# Altium project SA_ULWUR.PrjPcb
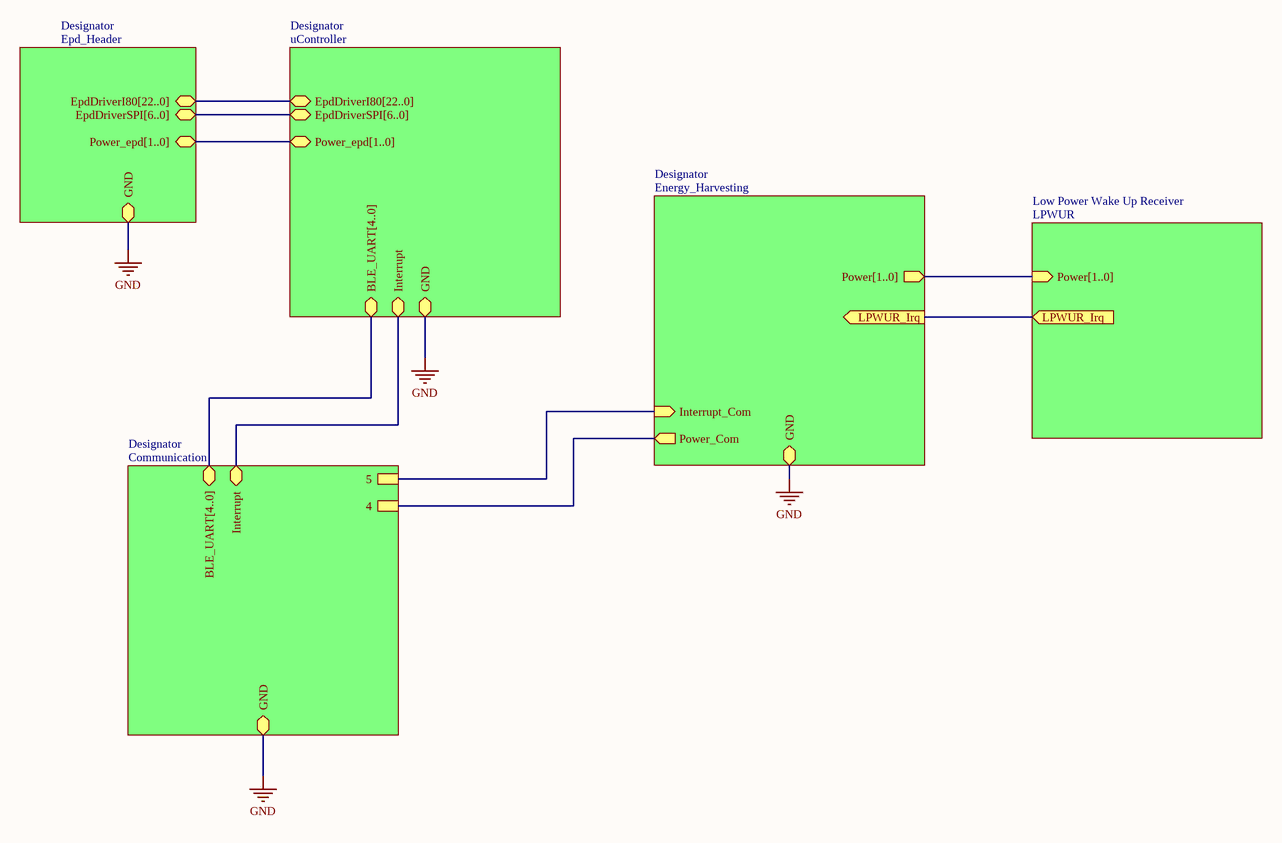
[diagram p0: Blockschaltbild.SchDoc]
7 sheets, 16 parts. Net scope: hierarchical (ports join the sheet entries above them; power ports are global).
Sheets:
  Blockschaltbild.SchDoc
    Designator = Epd_Header.SchDoc
    Designator = uController.SchDoc
    Designator = Communication.SchDoc
    Designator = Energy_Harvesting.SchDoc
  Epd.SchDoc
  Latch power supply.SchDoc

## Sheet Blockschaltbild.SchDoc: ULPWUR
size A3; Date: 11.11.2019; Author: Cédric Renda; CompanyName: HSR; DrawnBy: Cédric Renda; Organization: HSR

### Sub-sheets
Designator = Epd_Header: GND (bidir), Power_epd[1..0] (bidir), EpdDriverI80[22..0] (bidir), EpdDriverSPI[6..0] (bidir)
Designator = uController: Interrupt (bidir), Power_epd[1..0] (bidir), GND (bidir), EpdDriverI80[22..0] (bidir), BLE_UART[4..0] (bidir), EpdDriverSPI[6..0] (bidir)
Designator = Communication: 4, 5, Interrupt (bidir), GND (bidir), BLE_UART[4..0] (bidir)
Designator = Energy_Harvesting: Power_Com (out), Interrupt_Com (in), GND (bidir), Power[1..0] (out)
Low Power Wake Up Receiver = LPWUR (file not in this document): Power[1..0] (in)

### Ports
LPWUR_Irq (in), LPWUR_Irq (out)

### Nets
GND: sheet Designator/GND, sheet Designator/GND, sheet Designator/GND, sheet Designator/GND
(unnamed): sheet Designator/Interrupt, sheet Designator/Interrupt
(unnamed): sheet Designator/4, sheet Designator/Power_Com
(unnamed): sheet Designator/5, sheet Designator/Interrupt_Com

### Buses and harness runs
bus sheet Designator/Power[1..0] = sheet Low Power Wake Up Receiver/Power[1..0]

## Sheet Epd_Header.SchDoc
size A3
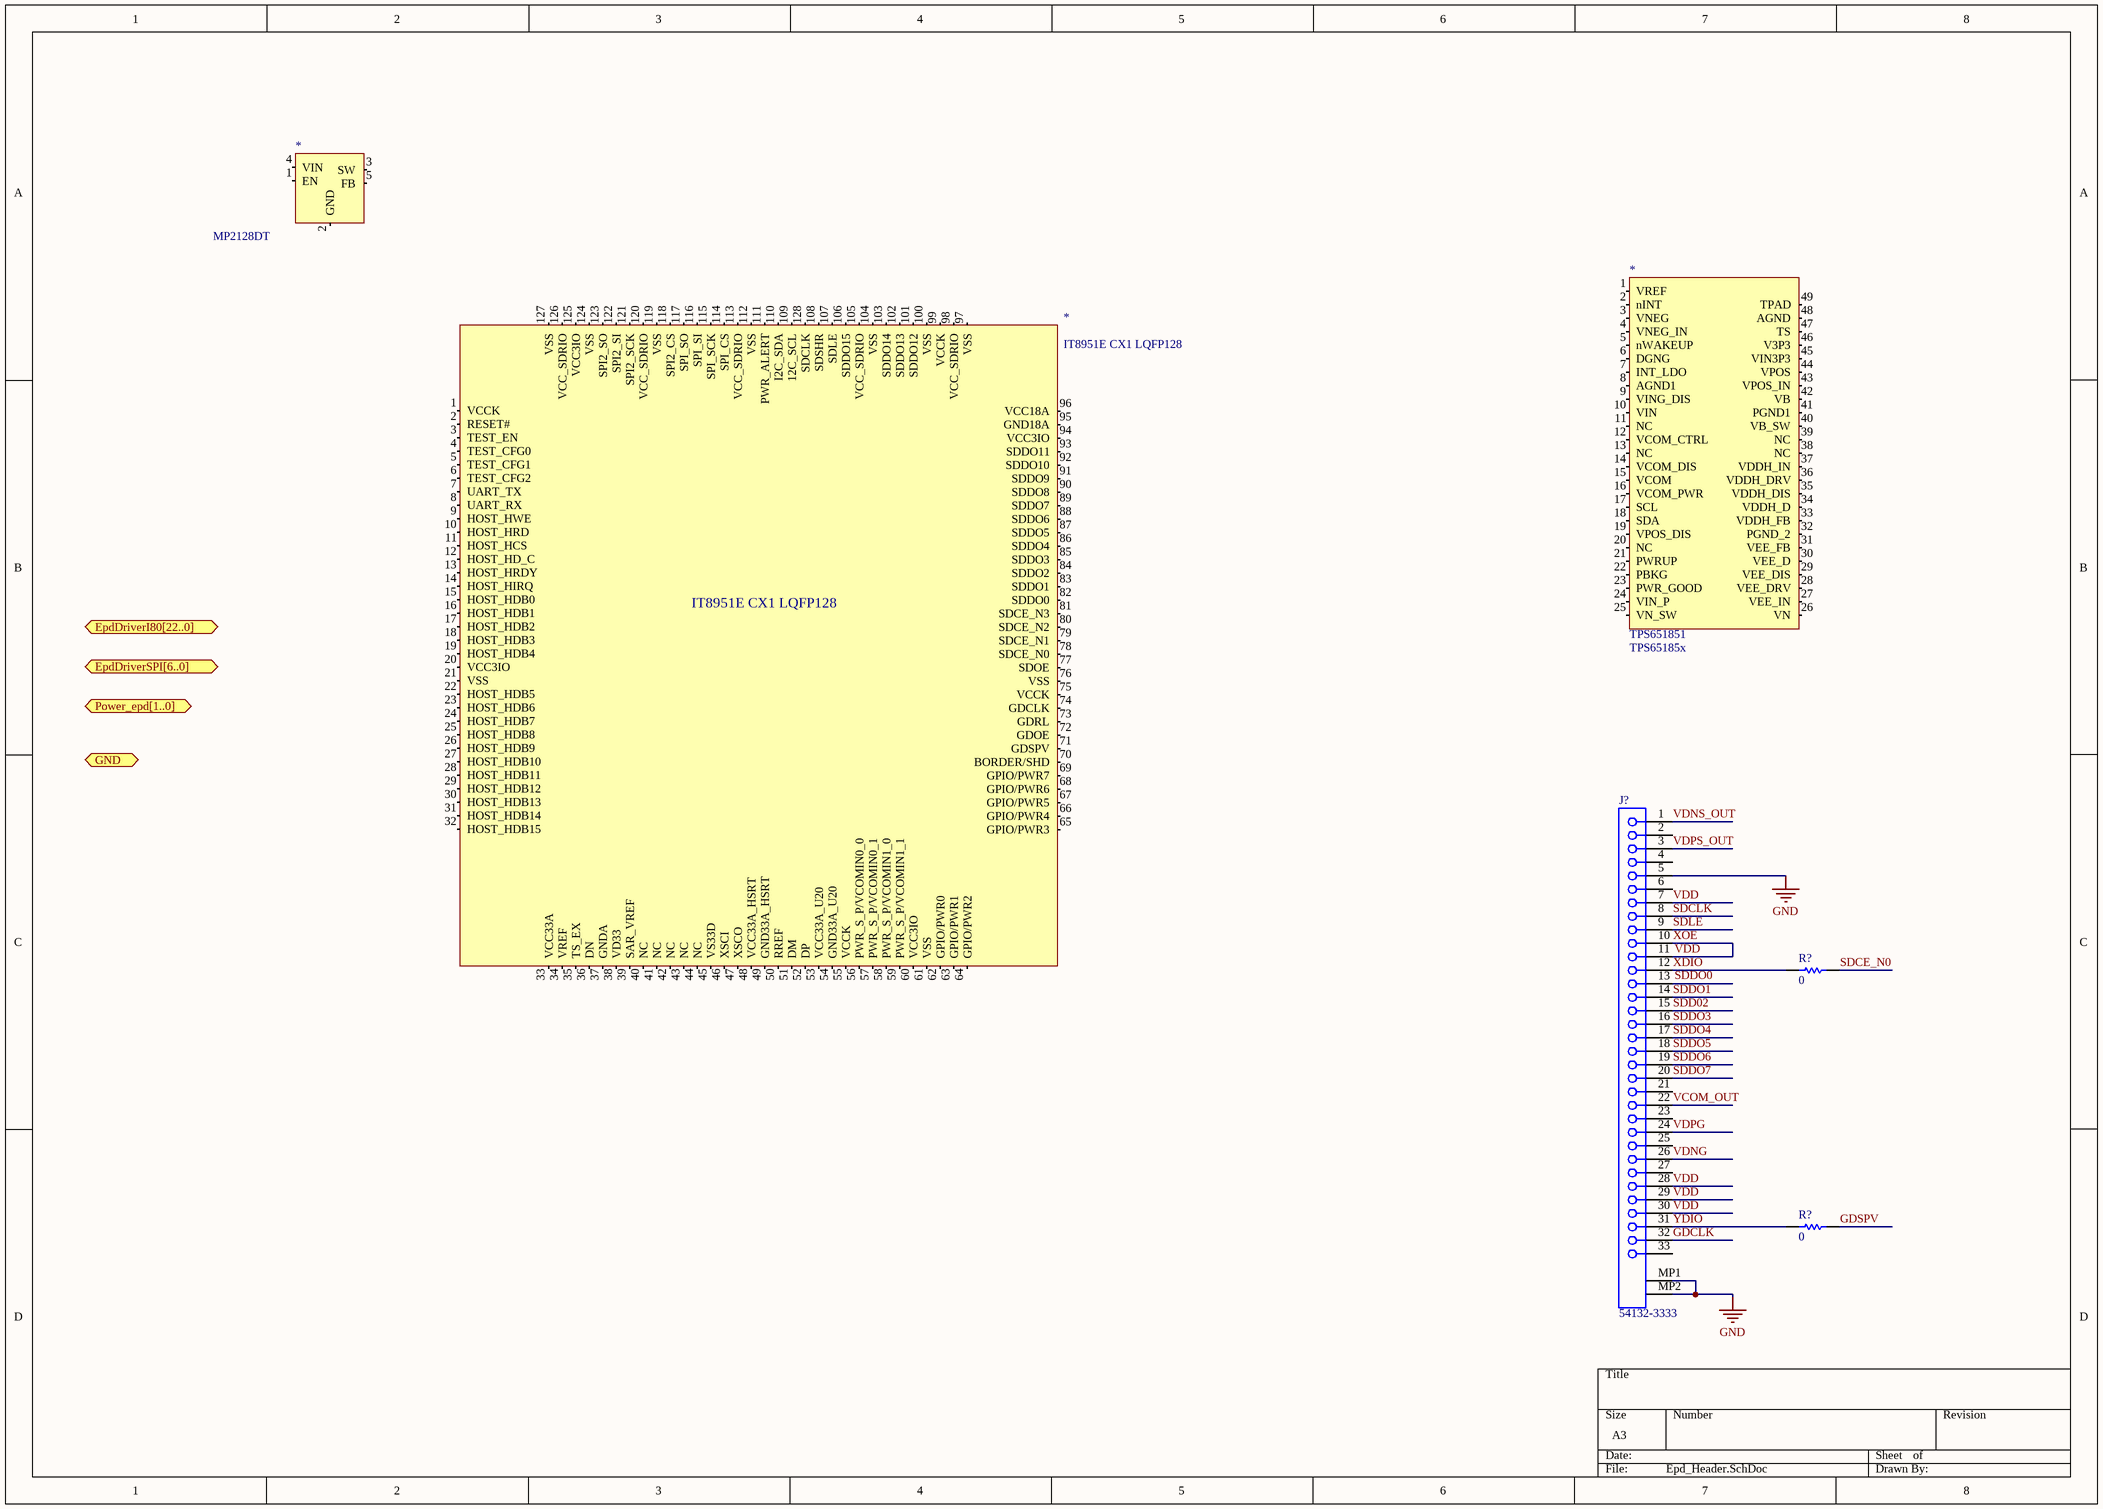
[diagram p1: Epd_Header.SchDoc]

### Parts
(Parts that share a designator on the sheet are numbered #1, #2 ... from top to bottom, then left to right.)
*#1  MP2128DT
*#2  TPS651851  Parameter 1: TPS65185x
*#3  ITEM: IT8951E CX1 LQFP128  (hidden comment: IT8951E DX LQFP128)
J?  54132-3333  [MOLX-54132-3333]
R?#1  0  [0603R]
R?#2  0  [0603R]

### Ports
EpdDriverI80[22..0] (bidir), EpdDriverSPI[6..0] (bidir), GND (bidir), Power_epd[1..0] (bidir)

### Nets
GND: J?.5 J?.MP1 J?.MP2 ; port GND
GDCLK: J?.32
GDSPV: R?#2.2
SDCE_N0: R?#1.2
SDCLK: J?.8
SDD02: J?.15
SDDO1: J?.14
SDDO3: J?.16
SDDO4: J?.17
SDDO5: J?.18
SDDO6: J?.19
SDDO7: J?.20
SDLE: J?.9
VCOM_OUT: J?.22
VDD: J?.7 J?.10 J?.11 J?.28 J?.29 J?.30  [also labelled XOE]
VDNG: J?.26
VDNS_OUT: J?.1
VDPG: J?.24
VDPS_OUT: J?.3
XDIO: J?.12 R?#1.1
YDIO: J?.31 R?#2.1

Not connected (* = marked no-connect by the designer): *#1 1(EN) 2(GND) 3(SW) 4(VIN) 5(FB); *#2 1(VREF) 2(nINT) 3(VNEG) 4(VNEG_IN) 5(nWAKEUP) 6(DGNG) 7(INT_LDO) 8(AGND1) 9(VING_DIS) 10(VIN) 11(NC) 12(VCOM_CTRL) 13(NC) 14(VCOM_DIS) 15(VCOM) 16(VCOM_PWR) 17(SCL) 18(SDA) 19(VPOS_DIS) 20(NC) 21(PWRUP) 22(PBKG) 23(PWR_GOOD) 24(VIN_P) 25(VN_SW) 26(VN) 27(VEE_IN) 28(VEE_DRV) 29(VEE_DIS) 30(VEE_D) 31(VEE_FB) 32(PGND_2) 33(VDDH_FB) 34(VDDH_D) 35(VDDH_DIS) 36(VDDH_DRV) 37(VDDH_IN) 38(NC) 39(NC) 40(VB_SW) 41(PGND1) 42(VB) 43(VPOS_IN) 44(VPOS) 45(VIN3P3) 46(V3P3) 47(TS) 48(AGND) 49(TPAD); *#3 1(VCCK) 2(RESET#) 3(TEST_EN) 4(TEST_CFG0) 5(TEST_CFG1) 6(TEST_CFG2) 7(UART_TX) 8(UART_RX) 9(HOST_HWE) 10(HOST_HRD) 11(HOST_HCS) 12(HOST_HD_C) 13(HOST_HRDY) 14(HOST_HIRQ) 15(HOST_HDB0) 16(HOST_HDB1) 17(HOST_HDB2) 18(HOST_HDB3) 19(HOST_HDB4) 20(VCC3IO) 21(VSS) 22(HOST_HDB5) 23(HOST_HDB6) 24(HOST_HDB7) 25(HOST_HDB8) 26(HOST_HDB9) 27(HOST_HDB10) 28(HOST_HDB11) 29(HOST_HDB12) 30(HOST_HDB13) 31(HOST_HDB14) 32(HOST_HDB15) 33(VCC33A) 34(VREF) 35(TS_EX) 36(DN) 37(GNDA) 38(VD33) 39(SAR_VREF) 40(NC) 41(NC) 42(NC) 43(NC) 44(NC) 45(VS33D) 46(XSCI) 47(XSCO) 48(VCC33A_HSRT) 49(GND33A_HSRT) 50(RREF) 51(DM) 52(DP) 53(VCC33A_U20) 54(GND33A_U20) 55(VCCK) 56(PWR_S_P/VCOMIN0_0) 57(PWR_S_P/VCOMIN0_1) 58(PWR_S_P/VCOMIN1_0) 59(PWR_S_P/VCOMIN1_1) 60(VCC3IO) 61(VSS) 62(GPIO/PWR0) 63(GPIO/PWR1) 64(GPIO/PWR2) 65(GPIO/PWR3) 66(GPIO/PWR4) 67(GPIO/PWR5) 68(GPIO/PWR6) 69(GPIO/PWR7) 70(BORDER/SHD) 71(GDSPV) 72(GDOE) 73(GDRL) 74(GDCLK) 75(VCCK) 76(VSS) 77(SDOE) 78(SDCE_N0) 79(SDCE_N1) 80(SDCE_N2) 81(SDCE_N3) 82(SDDO0) 83(SDDO1) 84(SDDO2) 85(SDDO3) 86(SDDO4) 87(SDDO5) 88(SDDO6) 89(SDDO7) 90(SDDO8) 91(SDDO9) 92(SDDO10) 93(SDDO11) 94(VCC3IO) 95(GND18A) 96(VCC18A) 97(VSS) 98(VCC_SDRIO) 99(VCCK) 100(VSS) 101(SDDO12) 102(SDDO13) 103(SDDO14) 104(VSS) 105(VCC_SDRIO) 106(SDDO15) 107(SDLE) 108(SDSHR) 109(12C_SCL) 110(I2C_SDA) 111(PWR_ALERT) 112(VSS) 113(VCC_SDRIO) 114(SPI_CS) 115(SPI_SCK) 116(SPI_SI) 117(SPI_SO) 118(SPI2_CS) 119(VSS) 120(VCC_SDRIO) 121(SPI2_SCK) 122(SPI2_SI) 123(SPI2_SO) 124(VSS) 125(VCC3IO) 126(VCC_SDRIO) 127(VSS) 128(SDCLK); J? 2 4 6 13 21 23 25 27 33

### Notes on the sheet
- Labels drawn without touching a wire or pin: SDDO0

### Library data of the parts
*#1 = MP2128DT: MP2128DT Step down 2.5-6V to 1.8V 1A
*#2 = TPS651851: TPS651851 TPS65185x PMIC for E Ink® Vizplex™ Enabled Electronic Paper Display /
J? = CMP-1241-00520-1: 0.5 mm Pitch Easy-On(TM) Type FPC Connector, 2.0 mm Mated Height, Right Angle, ZIF, SMT, Bottom Contact, 33 Circuits, -40 to 85 degC, ELV and RoHS Compliant, Tape and Reel; Manufacturer: Molex; PCB Retention: None; Voltage (Max): 50V; Durability (mating cycles max): 20; Material - Metal: Phosphor Bronze; Entry Angle: 90degrees Angle; Pitch - Mating Interface: 0.50mm; Mated Height: 2.00mm; Material - Plating Mating: Silver, Tin-Bismuth; Circuits (Loaded): 33; Polarized to PCB: Yes; Current (Max per Contact): 0.5A; Stackable: No; ComponentLink1URL: http://www.molex.com/molex/index.jsp; Number of Rows: 1; PackageVersion: Rev. A, 08/2013; ComponentLink2Description: Datasheet; PackageReference: 54132-3333; ComponentLink3URL: http://www.molex.com/pdm_docs/sd/541323333_sd.pdf; ComponentLink2URL: http://www.molex.com/webdocs/datasheets/pdf/en-us/0541323333_FFC_FPC_CONNECTORS.pdf; Mounting Technology: Surface Mount; Contact Position: Bottom; PackageDescription: 33-Lead FPC Connector, Pitch 0.5 mm; Pitch - Termination Interface: 0.50mm; ComponentLink1Description: Manufacturer URL; PartNumber: 54132-3333; RoHS: TRUE; Material - Plating Termination: Silver, Tin-Bismuth; Packing: Tape and Reel; PCB Locator: No; ComponentLink3Description: Package Specification; Orientation: Right Angle
R?#1 R?#2 = Res1_1: Resistor; Value: 1K; Published: 8-Jun-2000; Revision: July-2002: Re-released for DXP Platform.; Publisher: Altium Limited

## Sheet uController.SchDoc
size A4
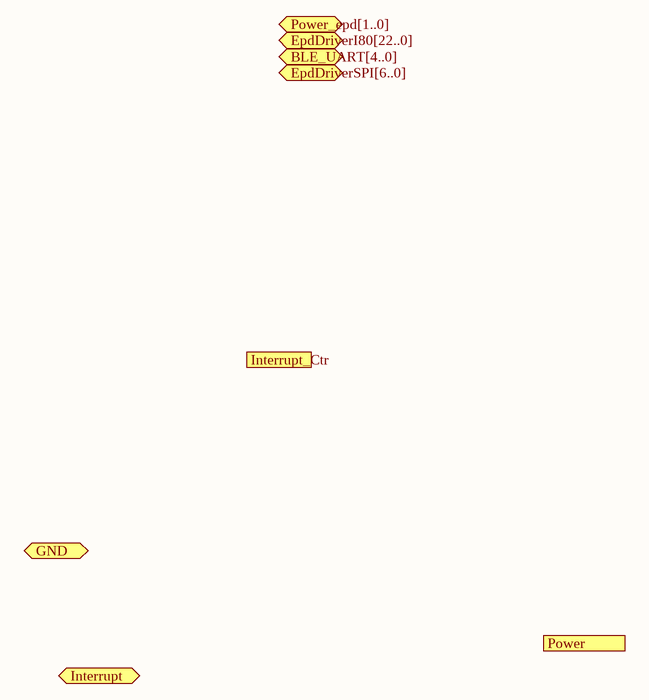
[diagram p2: uController.SchDoc]

### Ports
BLE_UART[4..0] (bidir), EpdDriverI80[22..0] (bidir), EpdDriverSPI[6..0] (bidir), GND (bidir), Interrupt (bidir), Interrupt_Ctr (in), Power (in), Power_epd[1..0] (bidir)

## Sheet Communication.SchDoc
size A4
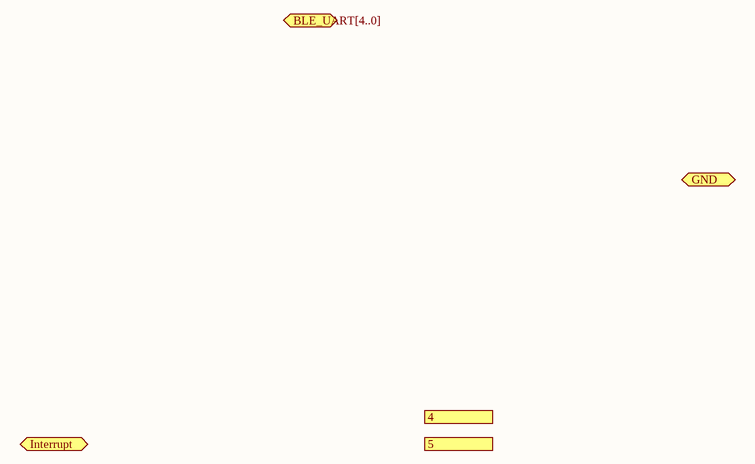
[diagram p3: Communication.SchDoc]

### Ports
4, 5, BLE_UART[4..0] (bidir), GND (bidir), Interrupt (bidir)

## Sheet Energy_Harvesting.SchDoc
size A4
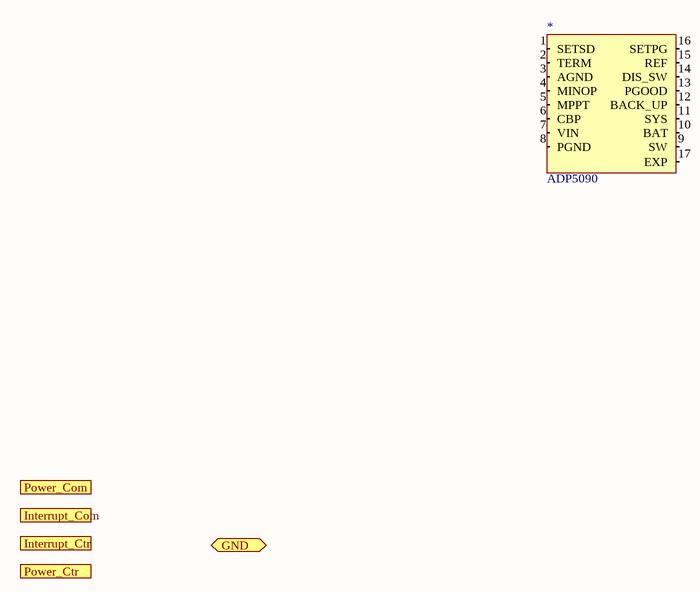
[diagram p4: Energy_Harvesting.SchDoc]

### Parts
(Parts that share a designator on the sheet are numbered #1, #2 ... from top to bottom, then left to right.)
*#4  ADP5090

### Ports
GND (bidir), Interrupt_Com (in), Interrupt_Ctr (out), Power_Com (out), Power_Ctr (out)

### Nets

Not connected (* = marked no-connect by the designer): *#4 1(SETSD) 2(TERM) 3(AGND) 4(MINOP) 5(MPPT) 6(CBP) 7(VIN) 8(PGND) 9(SW) 10(BAT) 11(SYS) 12(BACK_UP) 13(PGOOD) 14(DIS_SW) 15(REF) 16(SETPG) 17(EXP)

### Library data of the parts
*#4 = ADP5090: Ultralow Power Boost Regulator with / MPPT and Charge Management

## Sheet Epd.SchDoc
size A4; Organization: Altium Limited; Address1: L3, 12a Rodborough Rd; Address2: Frenchs Forest; Address3: NSW; Address4: Australia 2086
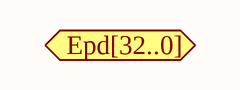
[diagram p5: Epd.SchDoc]

### Ports
Epd[32..0] (bidir)

### Notes on the sheet
- Title
- Size:
- Date:
- A4
- Number:
- Time:
- Revision:
- Sheet
- of
- File:

## Sheet Latch power supply.SchDoc: PowerLatch
size A3; Author: Cedric Renda; DrawnBy: Cedric Renda; Organization: HSR; Address1: Hochschule für Technik Rapperswil; Address2: Elektrotechnik; Address3: Oberseestrasse 10; Address4: CH-8640 Rapperswil
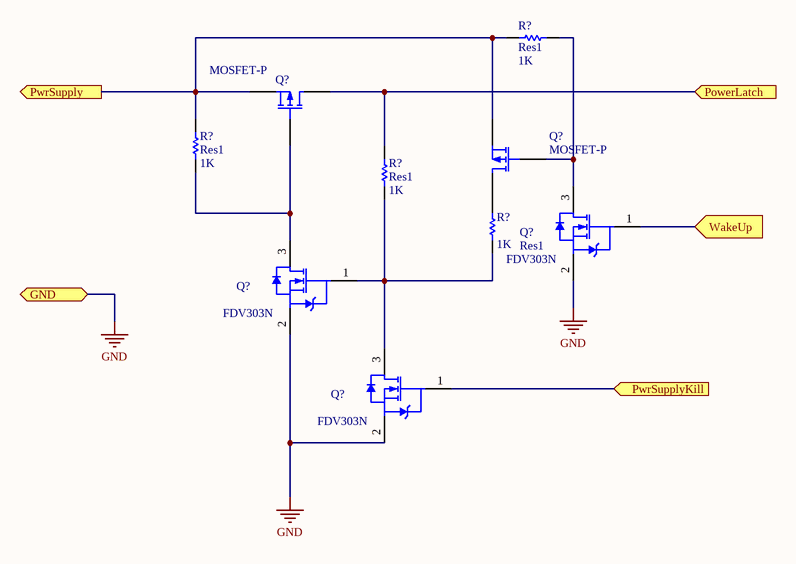
[diagram p6: Latch power supply.SchDoc]

### Parts
(Parts that share a designator on the sheet are numbered #1, #2 ... from top to bottom, then left to right.)
Q?#1  MOSFET-P  [E3]
Q?#2  MOSFET-P  [E3]
Q?#3  FDV303N  [FAIR-FDV303N-3_V]
Q?#4  FDV303N  [FAIR-FDV303N-3_V]
Q?#5  FDV303N  [FAIR-FDV303N-3_V]
R?#3  Res1  value 1K  [AXIAL-0.3]
R?#4  Res1  value 1K  [AXIAL-0.3]
R?#5  Res1  value 1K  [AXIAL-0.3]
R?#6  Res1  value 1K  [AXIAL-0.3]

### Ports
GND (bidir), PowerLatch (in), PwrSupply (out), PwrSupplyKill (in), WakeUp (in)

### Nets
GND: Q?#3.2(S) Q?#4.2(S) Q?#5.2(S) ; port GND
NetQ?#1_1: Q?#1.1(D) R?#5.1 ; port PowerLatch
NetQ?#1_2: Q?#1.2(G) Q?#4.3(D) R?#4.2
NetQ?#1_3: Q?#1.3(S) Q?#2.3(S) R?#3.2 R?#4.1 ; port PwrSupply
NetQ?#2_1: Q?#2.1(D) R?#6.2
NetQ?#2_2: Q?#2.2(G) Q?#3.3(D) R?#3.1
NetQ?#3_1: Q?#3.1(G) ; port WakeUp
NetQ?#4_1: Q?#4.1(G) Q?#5.3(D) R?#5.2 R?#6.1
NetQ?#5_1: Q?#5.1(G) ; port PwrSupplyKill

### Notes on the sheet
- Title
- Size:
- Date:
- A3
- Number:
- Time:
- Revision:
- Sheet
- of
- File:

### Library data of the parts
Q?#1 Q?#2 = MOSFET-P: P-Channel MOSFET; Published: 8-Jun-2000; LatestRevisionDate: 17-Jul-2002; LatestRevisionNote: Re-released for DXP Platform.; PackageVersion: 1995/1996; PackageReference: E3; Publisher: Altium Limited; PackageDescription: TO, Flat Index; 3 In-Line, Axial Leads; Body Dia. 4.6mm; Lead Dia. 0.5 mm (max)
Q?#3-Q?#5 = CMP-2000-05111-1: N-Channel MOSFET Transistor, 8 V VGSS, 25 V VDSS, 0.68 A, -55 to 150 degC, 3-Pin SOT23, RoHS, Tape and Reel; Manufacturer: Fairchild; Typical Turn-On Delay Time: 3ns; Channel Mode: Enhancement; RDS-on: 450@4.5VmOhm; Maximum Continuous Drain Current: 0.68A; Maximum Drain Source Voltage: 25V; Rad Hard: No; Typical Fall Time: 13ns; Channel Type: N; Typical Turn-Off Delay Time: 17ns; Maximum Gate Source Voltage: 8V; Typical Rise Time: 8.5ns; Mounting: SurfaceMount; Packaging: Tape&Reel; Manufacturer URL: https://www.fairchildsemi.com/; Datasheet URL: https://datasheet.ciiva.com/22681/1845307-22681736.pdf; Package: 3SOT-23; Category: MOSFET; Operating Temperature: -55to150degC; Datasheet Version: Rev. D2, 07/2014
R?#3-R?#6 = Res1: Resistor; Published: 8-Jun-2000; LatestRevisionDate: 17-Jul-2002; LatestRevisionNote: Re-released for DXP Platform.; PackageReference: AXIAL-0.3; Publisher: Altium Limited; PackageDescription: Axial Device, Thru-Hole; 2 Leads; 0.3 in Pin Spacing

## Nets that join several sheets
GND: Epd_Header (J?.5 J?.MP1 J?.MP2), Latch power supply (Q?#3.2 Q?#4.2 Q?#5.2)